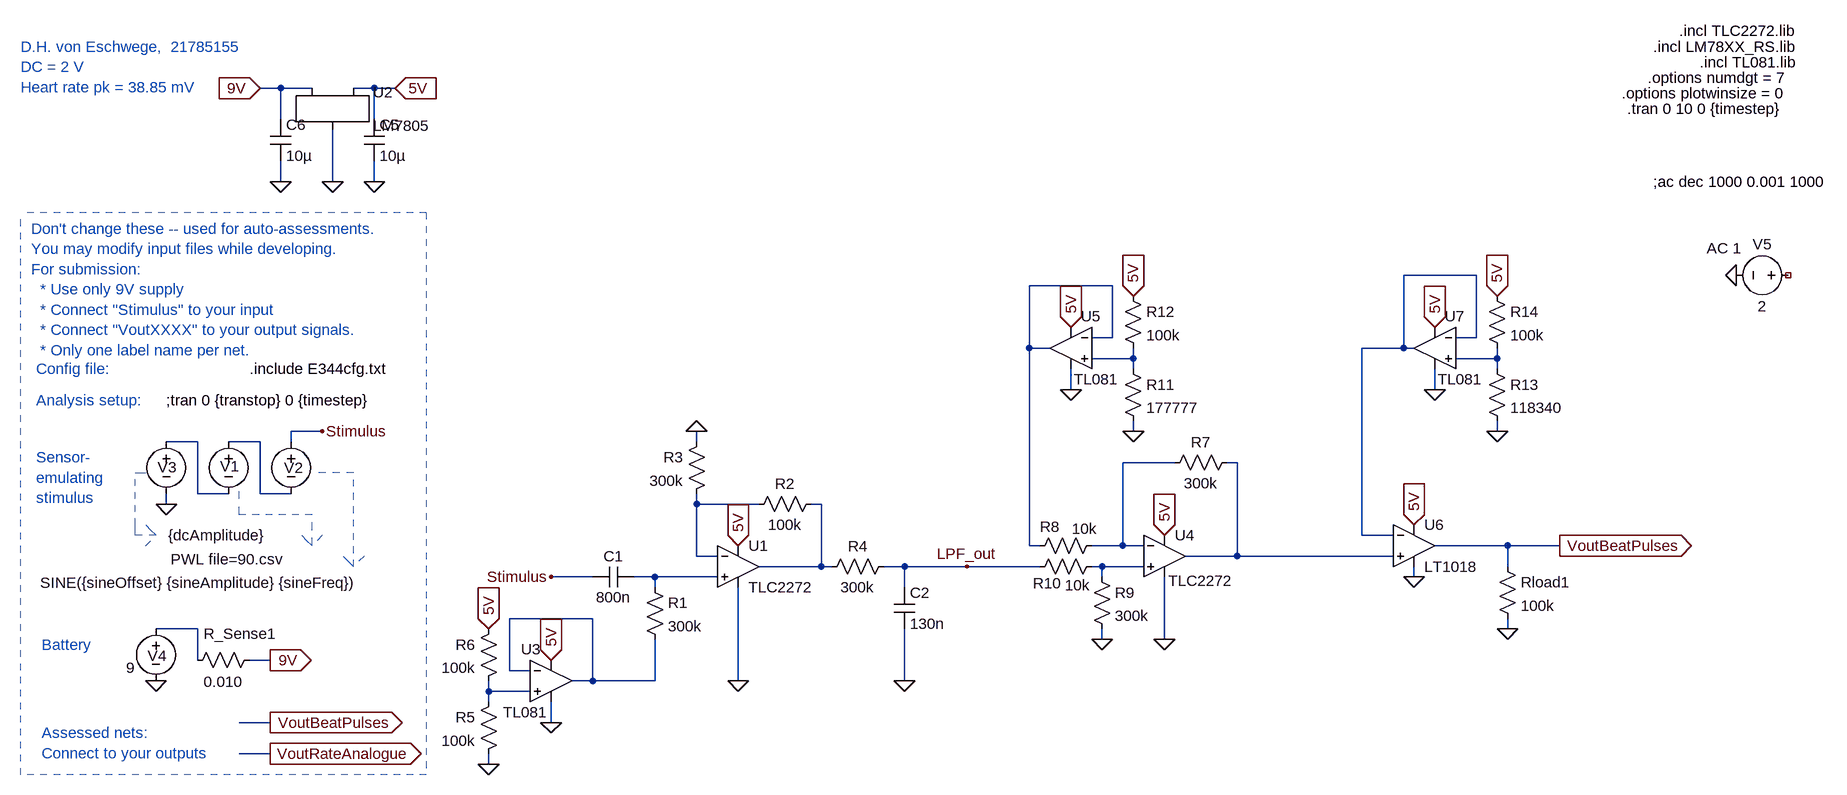
[diagram p0: schematic X_BPF.asc]
X_BPF.asc, the LTspice schematic file:
Version 4
SHEET 1 3360 1940
WIRE 912 480 880 480
WIRE 960 480 912 480
WIRE 1056 480 1024 480
WIRE 1088 480 1056 480
WIRE 912 528 912 480
WIRE 1056 528 1056 480
WIRE 912 624 912 592
WIRE 992 624 992 544
WIRE 1056 624 1056 592
WIRE 2752 768 2640 768
WIRE 2192 784 2064 784
WIRE 2192 864 2192 784
WIRE 2192 864 2160 864
WIRE 2752 864 2752 768
WIRE 2752 864 2720 864
WIRE 2064 880 2064 784
WIRE 2096 880 2064 880
WIRE 2640 880 2640 768
WIRE 2640 880 2576 880
WIRE 2656 880 2640 880
WIRE 2224 896 2224 880
WIRE 2224 896 2160 896
WIRE 2784 896 2784 880
WIRE 2784 896 2720 896
WIRE 2224 912 2224 896
WIRE 2784 912 2784 896
WIRE 2128 944 2128 912
WIRE 2688 944 2688 912
WIRE 976 1008 928 1008
WIRE 2224 1008 2224 992
WIRE 2784 1008 2784 992
WIRE 784 1024 736 1024
WIRE 880 1024 832 1024
WIRE 928 1024 928 1008
WIRE 1552 1024 1552 1008
WIRE 2288 1056 2208 1056
WIRE 2384 1056 2368 1056
WIRE 784 1104 784 1024
WIRE 832 1104 784 1104
WIRE 880 1104 880 1024
WIRE 928 1104 880 1104
WIRE 736 1120 736 1104
WIRE 1552 1120 1552 1104
WIRE 1648 1120 1552 1120
WIRE 1744 1120 1728 1120
WIRE 2576 1168 2576 880
WIRE 2624 1168 2576 1168
WIRE 2064 1184 2064 880
WIRE 2080 1184 2064 1184
WIRE 2208 1184 2208 1056
WIRE 2208 1184 2160 1184
WIRE 2240 1184 2208 1184
WIRE 2800 1184 2688 1184
WIRE 2880 1184 2800 1184
WIRE 1552 1200 1552 1120
WIRE 1584 1200 1552 1200
WIRE 2384 1200 2384 1056
WIRE 2384 1200 2304 1200
WIRE 2624 1200 2384 1200
WIRE 1744 1216 1744 1120
WIRE 1744 1216 1648 1216
WIRE 1760 1216 1744 1216
WIRE 1872 1216 1840 1216
WIRE 1968 1216 1872 1216
WIRE 2080 1216 1968 1216
WIRE 2176 1216 2160 1216
WIRE 2240 1216 2176 1216
WIRE 2800 1216 2800 1184
WIRE 1392 1232 1328 1232
WIRE 1488 1232 1456 1232
WIRE 1584 1232 1488 1232
WIRE 2176 1232 2176 1216
WIRE 2656 1232 2656 1216
WIRE 1488 1248 1488 1232
WIRE 1872 1248 1872 1216
WIRE 1392 1296 1264 1296
WIRE 784 1312 720 1312
WIRE 2800 1312 2800 1296
WIRE 2176 1328 2176 1312
WIRE 2272 1328 2272 1232
WIRE 784 1360 784 1312
WIRE 896 1360 864 1360
WIRE 1264 1376 1264 1296
WIRE 1296 1376 1264 1376
WIRE 1392 1392 1392 1296
WIRE 1392 1392 1360 1392
WIRE 1488 1392 1488 1328
WIRE 1488 1392 1392 1392
WIRE 1616 1392 1616 1248
WIRE 1872 1392 1872 1312
WIRE 1232 1408 1232 1392
WIRE 1296 1408 1232 1408
WIRE 1232 1424 1232 1408
WIRE 896 1456 848 1456
WIRE 1328 1456 1328 1424
WIRE 896 1504 848 1504
WIRE 1232 1520 1232 1504
FLAG 1552 1008 0
FLAG 1616 1184 5V
IOPIN 1616 1184 In
FLAG 736 1120 0
FLAG 976 1008 Stimulus
FLAG 896 1360 9V
IOPIN 896 1360 Out
FLAG 720 1392 0
FLAG 896 1456 VoutBeatPulses
IOPIN 896 1456 Out
FLAG 896 1504 VoutRateAnalogue
IOPIN 896 1504 Out
FLAG 992 624 0
FLAG 880 480 9V
IOPIN 880 480 In
FLAG 912 624 0
FLAG 1056 624 0
FLAG 1088 480 5V
IOPIN 1088 480 In
FLAG 3152 768 0
FLAG 1968 1216 LPF_out
FLAG 1232 1520 0
FLAG 1232 1312 5V
IOPIN 1232 1312 In
FLAG 1328 1456 0
FLAG 1328 1360 5V
IOPIN 1328 1360 In
FLAG 1328 1232 Stimulus
FLAG 1616 1392 0
FLAG 1872 1392 0
FLAG 2800 1312 0
FLAG 2272 1328 0
FLAG 2176 1328 0
FLAG 2224 1008 0
FLAG 2224 800 5V
IOPIN 2224 800 In
FLAG 2128 944 0
FLAG 2272 1168 5V
IOPIN 2272 1168 In
FLAG 2128 848 5V
IOPIN 2128 848 In
FLAG 2880 1184 VoutBeatPulses
IOPIN 2880 1184 Out
FLAG 2784 1008 0
FLAG 2784 800 5V
IOPIN 2784 800 In
FLAG 2688 944 0
FLAG 2688 848 5V
IOPIN 2688 848 In
FLAG 2656 1152 5V
IOPIN 2656 1152 In
FLAG 2656 1232 0
SYMBOL res 1472 1232 R0
SYMATTR InstName R1
SYMATTR Value 300k
SYMBOL cap 1456 1216 R90
WINDOW 0 0 32 VBottom 2
WINDOW 3 32 32 VTop 2
SYMATTR InstName C1
SYMATTR Value 800n
SYMBOL Opamps\\opamp2 1616 1152 R0
SYMATTR InstName U1
SYMATTR Value TLC2272
SYMBOL res 1744 1104 R90
WINDOW 0 0 56 VBottom 2
WINDOW 3 32 56 VTop 2
SYMATTR InstName R2
SYMATTR Value 100k
SYMBOL res 1568 1008 M0
SYMATTR InstName R3
SYMATTR Value 300k
SYMBOL res 1856 1200 R90
WINDOW 0 0 56 VBottom 2
WINDOW 3 32 56 VTop 2
SYMATTR InstName R4
SYMATTR Value 300k
SYMBOL cap 1856 1248 R0
SYMATTR InstName C2
SYMATTR Value 130n
SYMBOL voltage 832 1008 R0
WINDOW 123 0 0 Left 0
WINDOW 39 0 0 Left 0
WINDOW 3 -89 197 Left 2
WINDOW 0 -13 54 Left 2
SYMATTR Value PWL file=90.csv
SYMATTR InstName V1
SYMBOL voltage 928 1008 R0
WINDOW 123 24 44 Left 2
WINDOW 39 0 0 Left 0
WINDOW 3 -386 233 Left 2
WINDOW 0 -11 56 Left 2
SYMATTR Value SINE({sineOffset} {sineAmplitude} {sineFreq})
SYMATTR InstName V2
SYMBOL voltage 736 1008 R0
WINDOW 123 0 0 Left 0
WINDOW 39 0 0 Left 0
WINDOW 3 3 160 Left 2
WINDOW 0 -13 55 Left 2
SYMATTR Value {dcAmplitude}
SYMATTR InstName V3
SYMBOL voltage 720 1296 R0
WINDOW 123 24 44 Left 2
WINDOW 39 0 0 Left 0
WINDOW 3 -46 76 Left 2
WINDOW 0 -13 57 Left 2
SYMATTR Value 9
SYMATTR InstName V4
SYMBOL res 880 1344 R90
WINDOW 0 -9 30 VBottom 2
WINDOW 3 34 56 VTop 2
SYMATTR InstName R_Sense1
SYMATTR Value 0.010
SYMBOL LM7805 992 496 R0
SYMATTR InstName U2
SYMBOL cap 1040 528 R0
SYMATTR InstName C5
SYMATTR Value 10µ
SYMBOL cap 896 528 R0
SYMATTR InstName C6
SYMATTR Value 10µ
SYMBOL voltage 3248 768 R90
WINDOW 0 -32 56 VBottom 2
WINDOW 3 32 56 VTop 2
WINDOW 123 -26 115 VBottom 2
WINDOW 39 0 0 Left 0
SYMATTR InstName V5
SYMATTR Value 2
SYMATTR Value2 AC 1
SYMBOL res 1248 1408 M0
SYMATTR InstName R5
SYMATTR Value 100k
SYMBOL res 1248 1296 M0
SYMATTR InstName R6
SYMATTR Value 100k
SYMBOL Opamps\\opamp2 1328 1328 R0
WINDOW 0 -46 15 Left 2
WINDOW 3 -74 112 Left 2
SYMATTR InstName U3
SYMATTR Value TL081
SYMBOL res 2784 1200 R0
SYMATTR InstName Rload1
SYMATTR Value 100k
SYMBOL res 2384 1040 R90
WINDOW 0 0 56 VBottom 2
WINDOW 3 32 56 VTop 2
SYMATTR InstName R7
SYMATTR Value 300k
SYMBOL res 2176 1168 R90
WINDOW 0 2 80 VBottom 2
WINDOW 3 -26 27 VTop 2
SYMATTR InstName R8
SYMATTR Value 10k
SYMBOL Opamps\\opamp2 2272 1136 R0
WINDOW 3 6 102 Left 2
SYMATTR Value TLC2272
SYMATTR InstName U4
SYMBOL res 2160 1216 R0
SYMATTR InstName R9
SYMATTR Value 300k
SYMBOL res 2176 1200 R90
WINDOW 0 57 84 VBottom 2
WINDOW 3 29 38 VTop 2
SYMATTR InstName R10
SYMATTR Value 10k
SYMBOL res 2208 896 R0
SYMATTR InstName R11
SYMATTR Value 177777
SYMBOL res 2208 784 R0
SYMATTR InstName R12
SYMATTR Value 100k
SYMBOL Opamps\\opamp2 2128 816 M0
WINDOW 0 -46 15 Left 2
WINDOW 3 -74 112 Left 2
SYMATTR InstName U5
SYMATTR Value TL081
SYMBOL Comparators\\LT1018 2656 1184 R0
SYMATTR InstName U6
SYMBOL res 2768 896 R0
SYMATTR InstName R13
SYMATTR Value 118340
SYMBOL res 2768 784 R0
SYMATTR InstName R14
SYMATTR Value 100k
SYMBOL Opamps\\opamp2 2688 816 M0
WINDOW 0 -46 15 Left 2
WINDOW 3 -74 112 Left 2
SYMATTR InstName U7
SYMATTR Value TL081
TEXT 736 960 Left 2 !;tran 0 {transtop} 0 {timestep}
TEXT 864 912 Left 2 !.include E344cfg.txt
TEXT 528 696 Left 2 ;Don't change these -- used for auto-assessments.\nYou may modify input files while developing.\nFor submission: \n  * Use only 9V supply \n  * Connect "Stimulus" to your input\n  * Connect "VoutXXXX" to your output signals.\n  * Only one label name per net.
TEXT 536 912 Left 2 ;Config file:
TEXT 536 960 Left 2 ;Analysis setup:
TEXT 544 1336 Left 2 ;Battery
TEXT 536 1048 Left 2 ;Sensor-\nemulating \nstimulus
TEXT 544 1472 Left 2 ;Assessed nets:\nConnect to your outputs
TEXT 512 416 Left 2 ;D.H. von Eschwege,  21785155\nDC = 2 V\nHeart rate pk = 38.85 mV
TEXT 3064 392 Left 2 !.incl TLC2272.lib
TEXT 3024 416 Left 2 !.incl LM78XX_RS.lib
TEXT 3096 440 Left 2 !.incl TL081.lib
TEXT 3016 464 Left 2 !.options numdgt = 7
TEXT 2976 488 Left 2 !.options plotwinsize = 0
TEXT 3024 624 Left 2 !;ac dec 1000 0.001 1000
TEXT 2984 512 Left 2 !.tran 0 10 0 {timestep}
LINE Normal 1024 1072 960 1072 2
LINE Normal 1024 1216 1024 1072 2
LINE Normal 1008 1200 1024 1216 2
LINE Normal 1024 1216 1008 1200 2
LINE Normal 1040 1200 1024 1216 2
LINE Normal 688 1072 704 1072 2
LINE Normal 688 1152 688 1072 2
LINE Normal 688 1168 688 1152 2
LINE Normal 720 1168 688 1168 2
LINE Normal 704 1152 720 1168 2
LINE Normal 720 1168 704 1152 2
LINE Normal 704 1184 720 1168 2
LINE Normal 848 1136 848 1088 2
LINE Normal 960 1136 848 1136 2
LINE Normal 960 1184 960 1136 2
LINE Normal 944 1168 960 1184 2
LINE Normal 960 1184 944 1168 2
LINE Normal 976 1168 960 1184 2
LINE Normal 512 1536 512 672 1
LINE Normal 1136 672 1136 1536 1
LINE Normal 1136 1536 512 1536 1
LINE Normal 1136 672 512 672 1

The netlist it stands for:
* X_BPF.asc
R1 N012 N013 300k
C1 N012 Stimulus 800n
XU1 N012 N009 5V 0 N010 TLC2272  ; pins In+ In- V+ V- OUT
R2 N010 N009 100k
R3 0 N009 300k
R4 LPF_out N010 300k
C2 LPF_out 0 130n
V1 N006 N005 PWL file=90.csv
V2 Stimulus N006 SINE({sineOffset} {sineAmplitude} {sineFreq})
V3 N005 0 {dcAmplitude}
V4 N014 0 9
R_Sense1 9V N014 0.010
XU2 9V 0 5V LM7805
C5 5V 0 10µ
C6 9V 0 10µ
V5 NC_01 0 2 AC 1
R5 N015 0 100k
R6 5V N015 100k
XU3 N015 N013 5V 0 N013 TL081  ; pins In+ In- V+ V- OUT
Rload1 VoutBeatPulses 0 100k
R7 N008 N007 300k
R8 N007 N002 10k
XU4 N011 N007 5V 0 N008 TLC2272  ; pins In+ In- V+ V- OUT
R9 N011 0 300k
R10 N011 LPF_out 10k
R11 N003 0 177777
R12 5V N003 100k
XU5 N003 N002 5V 0 N002 TL081  ; pins In+ In- V+ V- OUT
XU6 N008 N001 5V 0 VoutBeatPulses LT1018  ; pins In+ In- V+ V- OUT
R13 N004 0 118340
R14 5V N004 100k
XU7 N004 N001 5V 0 N001 TL081  ; pins In+ In- V+ V- OUT
;tran 0 {transtop} 0 {timestep}
.include E344cfg.txt
* Don't change these -- used for auto-assessments.
* You may modify input files while developing.
* For submission:
*   * Use only 9V supply
*   * Connect "Stimulus" to your input
*   * Connect "VoutXXXX" to your output signals.
*   * Only one label name per net.
* Config file:
* Analysis setup:
* Battery
* Sensor-
* emulating
* stimulus
* Assessed nets:
* Connect to your outputs
* D.H. von Eschwege,  21785155
* DC = 2 V
* Heart rate pk = 38.85 mV
.incl TLC2272.lib
.incl LM78XX_RS.lib
.incl TL081.lib
.options numdgt = 7
.options plotwinsize = 0
;ac dec 1000 0.001 1000
.tran 0 10 0 {timestep}
.lib LTC1.lib
.backanno
.end